# Altium schematic sheet Title Sheet.SchDoc: Bluebell Pod
size B; Author: DM; CompanyName: Silver Bullet Technology LLC; DrawnBy: D.McIntire; Engineer: DM; Organization: Silver Bullet Technology; Address1: Schematic; Address2: 5300 Via Andrea; Address3: Newbury Park, CA 91320; Address4: USA; DocumentNumber: BLUEBELL-POD; SheetNumber: 1; SheetTotal: 11; PageSetup: Record=PageOptions|CenterHorizontal=True|CenterVertical=True|PrintScale=0.91|XCorrection=1.00|YCorrection=1.00|PrintKind=0|BorderSize=5000000|LeftOffset=0|BottomOffset=0|Orientation=2|PaperLength=1000|PaperWidth=1000|Scale=100|PaperSource=7|PrintQuality=-4|MediaType=1|DitherType=10|PaperKind=11 x 17|PrintScaleMode=1
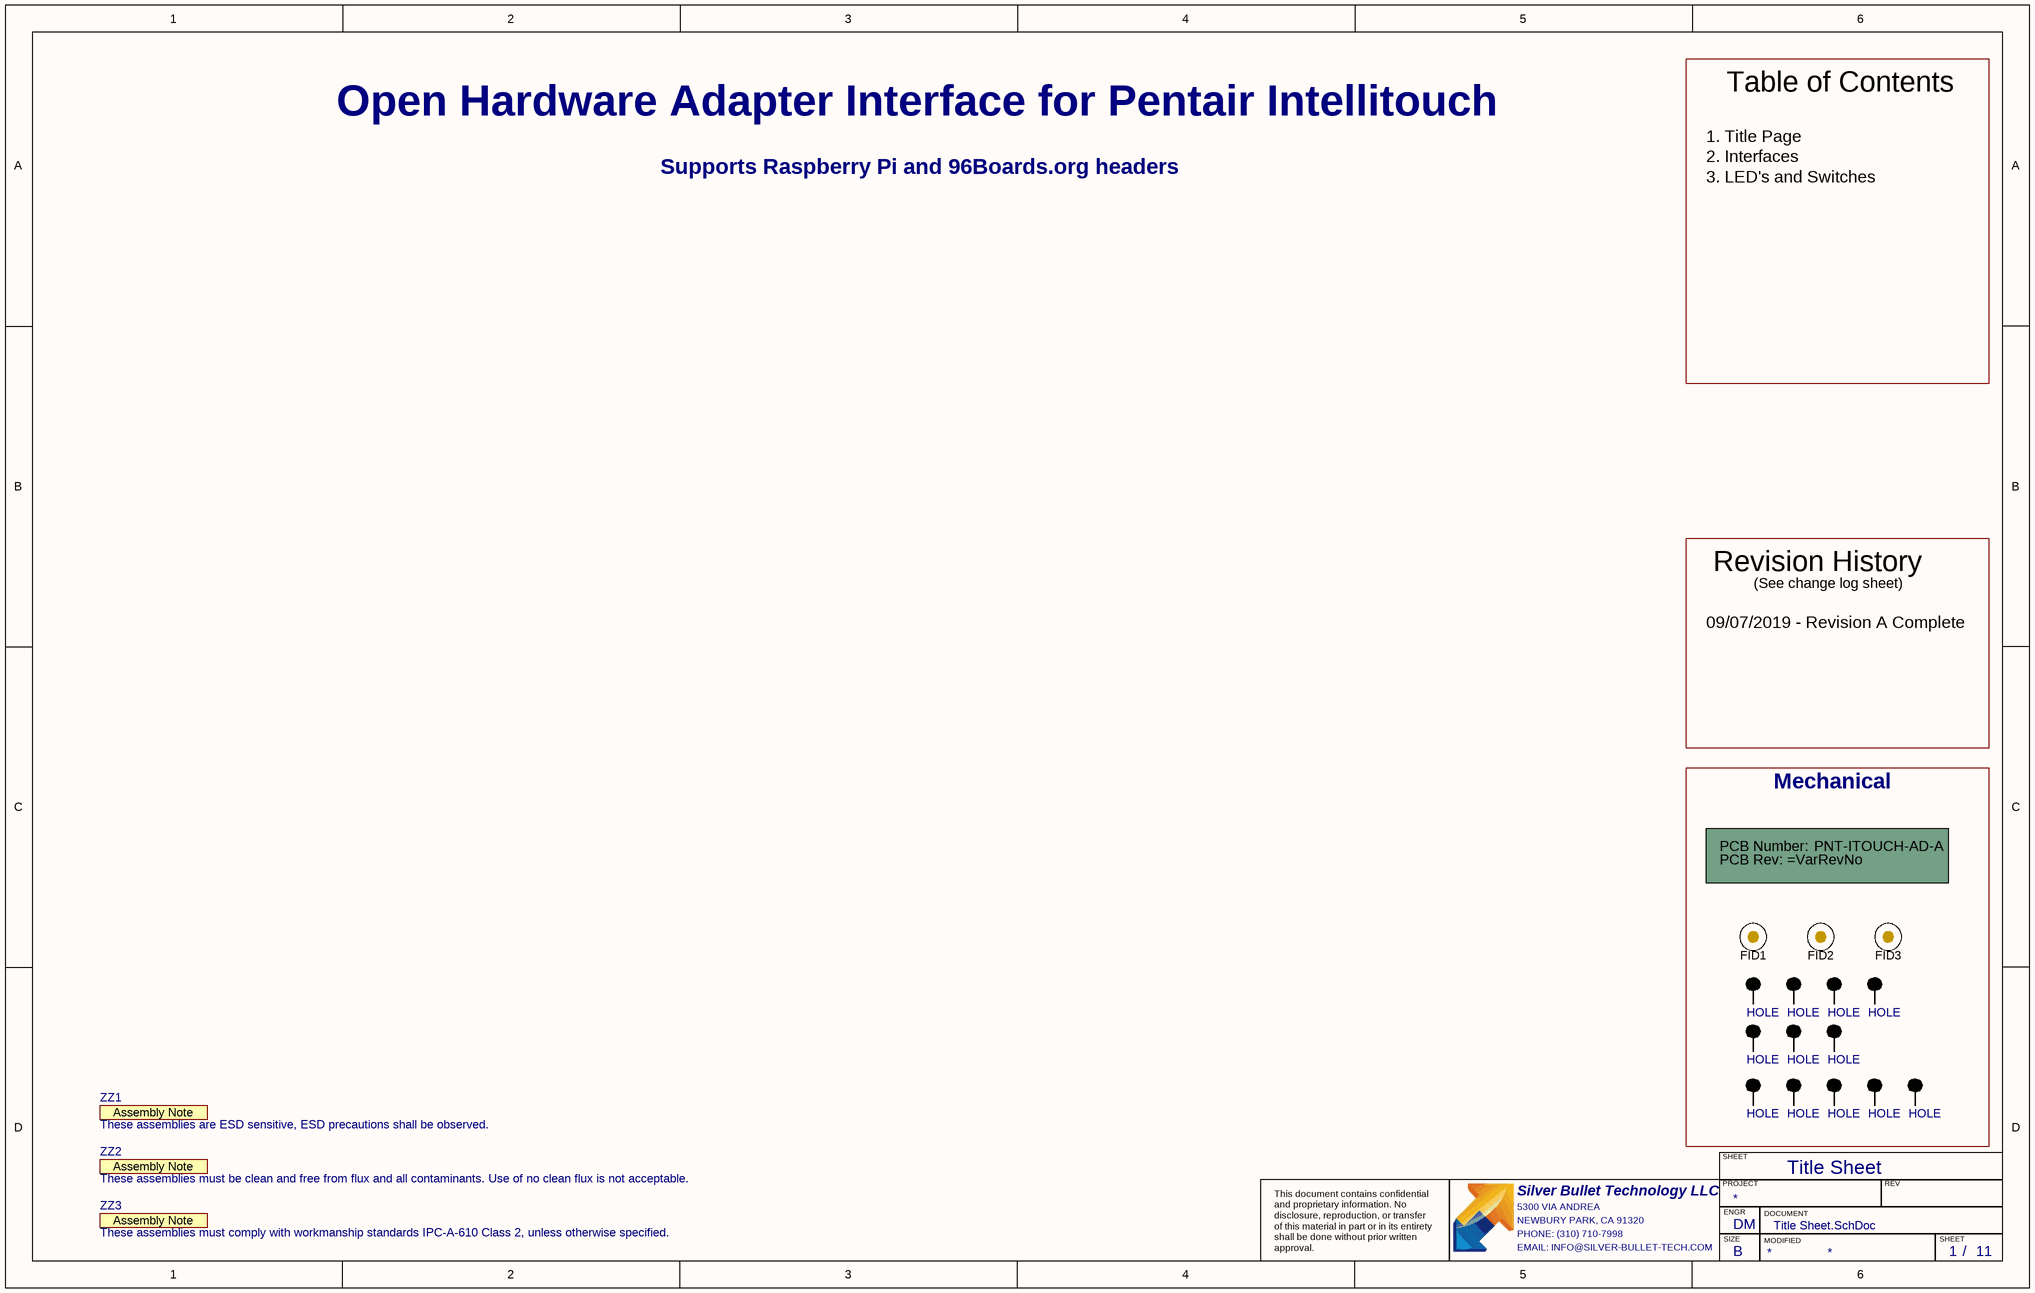
[diagram p0: Title Sheet.SchDoc]

## Parts
!PCB1  Printed Circuit Board  (value not drawn)  (graphical)
FID1  Fiducial  [Fiducial10-20]  (value not drawn)  (no BOM)
FID2  Fiducial  [Fiducial10-20]  (value not drawn)  (no BOM)
FID3  Fiducial  [Fiducial10-20]  (value not drawn)  (no BOM)
Z1  HOLE  [MTG-200-NP]  (no BOM)
Z2  HOLE  [MTG-200-NP]  (no BOM)
Z3  HOLE  [MTG-200-NP]  (no BOM)
Z4  HOLE  [MTG-200-NP]  (no BOM)
Z5  HOLE  [MTG-200-NP]  (no BOM)
Z6  HOLE  [MTG-200-NP]  (no BOM)
Z7  HOLE  [MTG-200-NP]  (no BOM)
Z8  HOLE  [MTG-300-NP]  (no BOM)
Z9  HOLE  [MTG-300-NP]  (no BOM)
Z10  HOLE  [MTG-300-NP]  (no BOM)
Z11  HOLE  [MTG-300-NP]  (no BOM)
Z12  HOLE  [MTG-300-NP]  (no BOM)
ZZ1  These assemblies are ESD sensitive, ESD precautions shall be observed.  [AssemblyNote]  (graphical)
ZZ2  These assemblies must be clean and free from flux and all contaminants. Use of no clean flux is not acceptable.  [AssemblyNote]  (graphical)
ZZ3  These assemblies must comply with workmanship standards IPC-A-610 Class 2, unless otherwise specified.  [AssemblyNote]  (graphical)

## Blocks framed on the sheet
Mechanical: !PCB1 FID1-FID3 Z1-Z12

## Nets

Not connected (* = marked no-connect by the designer): Z1 1; Z2 1; Z3 1; Z4 1; Z5 1; Z6 1; Z7 1; Z8 1; Z9 1; Z10 1; Z11 1; Z12 1

## Notes on the sheet
- Table of Contents
- Open Hardware Adapter Interface for Pentair Intellitouch
- 1. Title Page
- 2. Interfaces
- Supports Raspberry Pi and 96Boards.org headers
- 3. LED's and Switches
- 09/07/2019 - Revision A Complete
- Revision History
- (See change log sheet)
- Title Sheet
- SHEET
- Silver Bullet Technology LLC
- 5300 VIA ANDREA
- NEWBURY PARK, CA 91320
- PHONE: (310) 710-7998
- PROJECT
- SIZE
- ENGR
- MODIFIED
- DOCUMENT
- REV
- This document contains confidential and proprietary information. No disclosure, reproduction, or transfer of this material in part or in its entirety shall be done without prior written approval.
- EMAIL: INFO@SILVER-BULLET-TECH.COM
- B
- /
- (in symbol AssemblyNote) Assembly Note
- (in symbol PCB) PCB Number:; PCB Rev:

## Library data of the parts
!PCB1 = PCB: Manufacturer: Any; PartNumber: PNT-ITOUCH-AD-A; CompType: PCB; RoHS: O
FID1-FID3 = Fiducial: FIDUCIAL NO ASSEMBLY; Manufacturer 1: NONE; Manufacturer Part Number 1: NONE; Value: Fiducial
Z1-Z12 = HOLE: PCB HOLE; Manfucturer 1: N/A; Manfucturer Part Number 1: N/A; Value: HOLE
ZZ1-ZZ3 = AssemblyNote: SymbolCreator: codlsc; SymbolVersion: 2010-05-18; CompType: AssemblyNote; ClassName: AssemblyNote; Publisher: Texas Instruments; LatestRevisionDate: 2012-06-14; LatestRevisionNote: Initial Version; Alternate Manufacturer: -; Alternate PartNumber: -